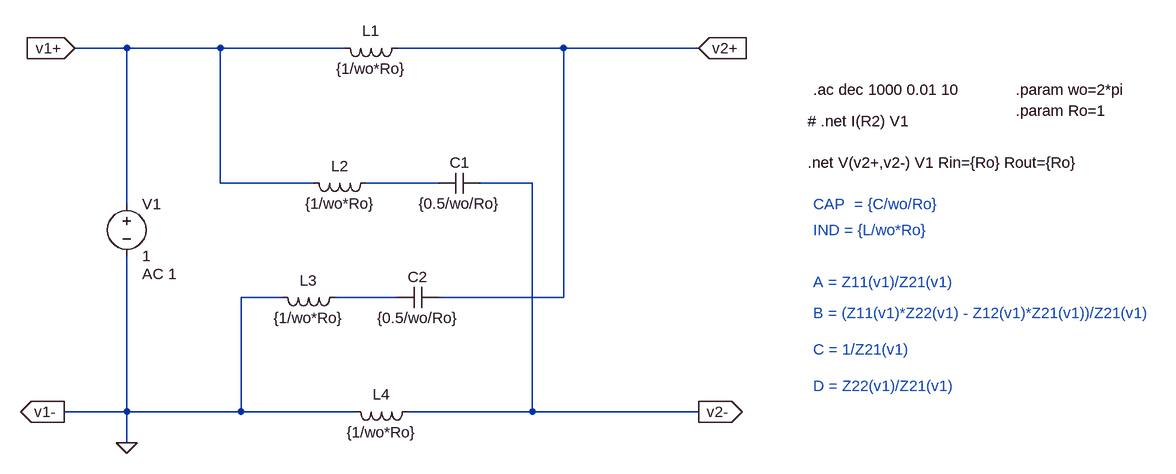
[diagram p0: schematic ej1cCuadripolos-Lattice.asc]
ej1cCuadripolos-Lattice.asc, the LTspice schematic file:
Version 4.1
SHEET 1 1564 680
WIRE -800 -48 -880 -48
WIRE -656 -48 -800 -48
WIRE -464 -48 -656 -48
WIRE -128 -48 -384 -48
WIRE 80 -48 -128 -48
WIRE -656 160 -656 -48
WIRE -512 160 -656 160
WIRE -320 160 -432 160
WIRE -176 160 -256 160
WIRE -800 192 -800 -48
WIRE -560 336 -624 336
WIRE -384 336 -480 336
WIRE -128 336 -128 -48
WIRE -128 336 -320 336
WIRE -800 512 -800 272
WIRE -800 512 -896 512
WIRE -624 512 -624 336
WIRE -624 512 -800 512
WIRE -448 512 -624 512
WIRE -176 512 -176 160
WIRE -176 512 -368 512
WIRE 80 512 -176 512
WIRE -800 560 -800 512
FLAG -880 -48 v1+
IOPIN -880 -48 In
FLAG -896 512 v1-
IOPIN -896 512 Out
FLAG 80 -48 v2+
IOPIN 80 -48 In
FLAG 80 512 v2-
IOPIN 80 512 Out
FLAG -800 560 0
SYMBOL voltage -800 176 R0
WINDOW 123 24 124 Left 2
WINDOW 39 0 0 Left 0
SYMATTR Value2 AC 1
SYMATTR InstName V1
SYMATTR Value 1
SYMBOL ind -368 -64 R90
WINDOW 0 5 56 VBottom 2
WINDOW 3 32 56 VTop 2
SYMATTR InstName L1
SYMATTR Value {1/wo*Ro}
SYMATTR SpiceLine Rser=1m
SYMBOL ind -416 144 R90
WINDOW 0 5 56 VBottom 2
WINDOW 3 32 56 VTop 2
SYMATTR InstName L2
SYMATTR Value {1/wo*Ro}
SYMATTR SpiceLine Rser=1m
SYMBOL cap -256 144 R90
WINDOW 0 0 32 VBottom 2
WINDOW 3 32 32 VTop 2
SYMATTR InstName C1
SYMATTR Value {0.5/wo/Ro}
SYMBOL ind -464 320 R90
WINDOW 0 5 56 VBottom 2
WINDOW 3 32 56 VTop 2
SYMATTR InstName L3
SYMATTR Value {1/wo*Ro}
SYMATTR SpiceLine Rser=1m
SYMBOL cap -320 320 R90
WINDOW 0 0 32 VBottom 2
WINDOW 3 32 32 VTop 2
SYMATTR InstName C2
SYMATTR Value {0.5/wo/Ro}
SYMBOL ind -352 496 R90
WINDOW 0 5 56 VBottom 2
WINDOW 3 32 56 VTop 2
SYMATTR InstName L4
SYMATTR Value {1/wo*Ro}
SYMATTR SpiceLine Rser=1m
TEXT 256 16 Left 2 !.ac dec 1000 0.01 10
TEXT 248 64 Left 2 !# .net I(R2) V1
TEXT 248 128 Left 2 !.net V(v2+,v2-) V1 Rin={Ro} Rout={Ro}
TEXT 568 16 Left 2 !.param wo=2*pi
TEXT 568 48 Left 2 !.param Ro=1
TEXT 256 312 Left 2 ;A = Z11(v1)/Z21(v1)
TEXT 256 360 Left 2 ;B = (Z11(v1)*Z22(v1) - Z12(v1)*Z21(v1))/Z21(v1)
TEXT 256 416 Left 2 ;C = 1/Z21(v1)
TEXT 256 472 Left 2 ;D = Z22(v1)/Z21(v1)
TEXT 256 192 Left 2 ;CAP  = {C/wo/Ro}
TEXT 256 232 Left 2 ;IND = {L/wo*Ro}

The netlist it stands for:
* ej1cCuadripolos-Lattice.asc
V1 v1+ 0 1 AC 1
L1 v2+ v1+ {1/wo*Ro} Rser=1m
L2 N001 v1+ {1/wo*Ro} Rser=1m
C1 v2- N001 {0.5/wo/Ro}
L3 N002 0 {1/wo*Ro} Rser=1m
C2 v2+ N002 {0.5/wo/Ro}
L4 v2- 0 {1/wo*Ro} Rser=1m
.ac dec 1000 0.01 10
# .net I(R2) V1
.net V(v2+,v2-) V1 Rin={Ro} Rout={Ro}
.param wo=2*pi
.param Ro=1
* A = Z11(v1)/Z21(v1)
* B = (Z11(v1)*Z22(v1) - Z12(v1)*Z21(v1))/Z21(v1)
* C = 1/Z21(v1)
* D = Z22(v1)/Z21(v1)
* CAP  = {C/wo/Ro}
* IND = {L/wo*Ro}
.backanno
.end